# Altium project PWR_MANAGE.PRJPCB
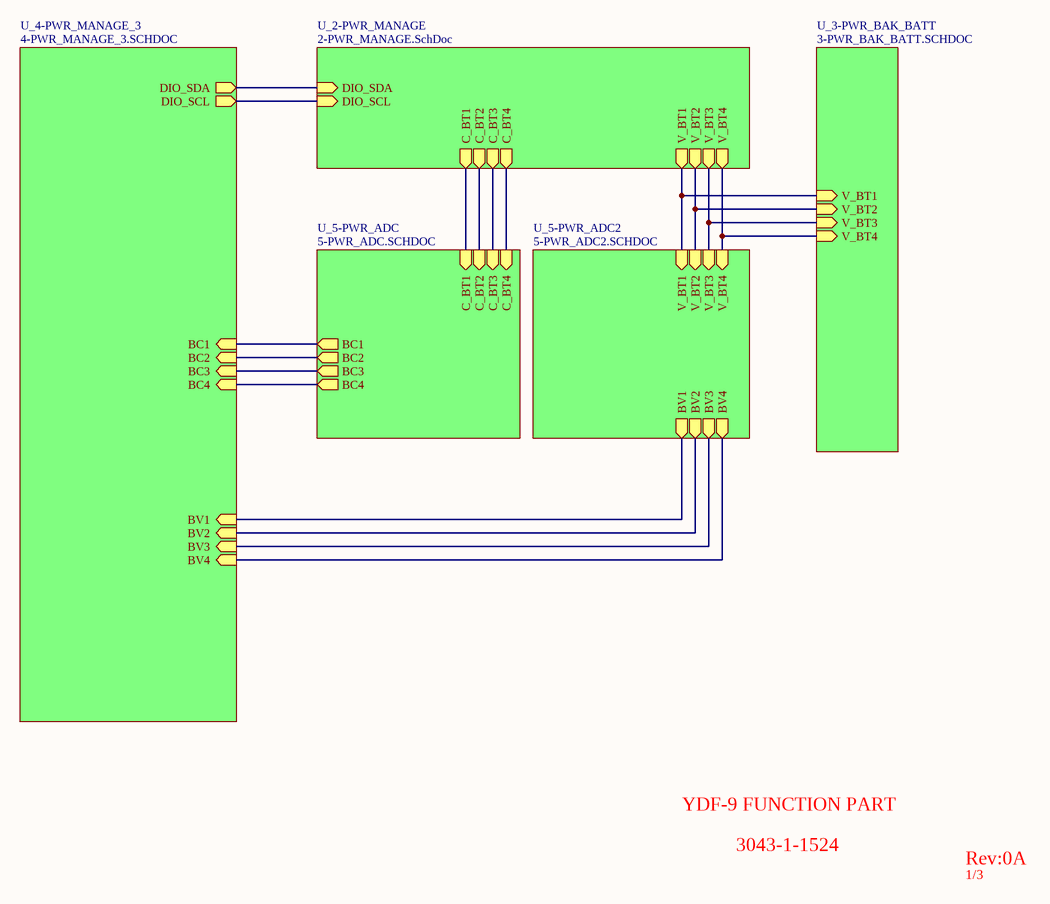
[diagram p0: 0-OverView.SCHDOC]
.TITLE: aaaaa
6 sheets, 155 parts. Net scope: hierarchical (ports join the sheet entries above them; power ports are global).
Board file: 3043-1-1532.PcbDoc
Sheets:
  0-OverView.SCHDOC
    U_2-PWR_MANAGE = 2-PWR_MANAGE.SchDoc
    U_3-PWR_BAK_BATT = 3-PWR_BAK_BATT.SCHDOC
    U_4-PWR_MANAGE_3 = 4-PWR_MANAGE_3.SCHDOC
    U_5-PWR_ADC = 5-PWR_ADC.SCHDOC
    U_5-PWR_ADC2 = 5-PWR_ADC2.SCHDOC

## Sheet 0-OverView.SCHDOC
size A4

### Sub-sheets
U_2-PWR_MANAGE = 2-PWR_MANAGE.SchDoc: V_BT1 (out), V_BT2 (out), V_BT3 (out), V_BT4 (out), C_BT1 (out), C_BT2 (out), C_BT3 (out), C_BT4 (out), DIO_SDA (in), DIO_SCL (in)
U_3-PWR_BAK_BATT = 3-PWR_BAK_BATT.SCHDOC: V_BT2 (in), V_BT4 (in), V_BT1 (in), V_BT3 (in)
U_4-PWR_MANAGE_3 = 4-PWR_MANAGE_3.SCHDOC: DIO_SDA (out), DIO_SCL (out), BC1 (in), BV2 (in), BV1 (in), BV3 (in), BC4 (in), BV4 (in), BC2 (in), BC3 (in)
U_5-PWR_ADC = 5-PWR_ADC.SCHDOC: C_BT1 (in), C_BT2 (in), C_BT3 (in), C_BT4 (in), BC1 (out), BC2 (out), BC3 (out), BC4 (out)
U_5-PWR_ADC2 = 5-PWR_ADC2.SCHDOC: V_BT1 (in), V_BT2 (in), V_BT3 (in), V_BT4 (in), BV2 (out), BV3 (out), BV4 (out), BV1 (out)

### Nets
BC1: sheet U_4-PWR_MANAGE_3/BC1, sheet U_5-PWR_ADC/BC1
BC2: sheet U_4-PWR_MANAGE_3/BC2, sheet U_5-PWR_ADC/BC2
BC3: sheet U_4-PWR_MANAGE_3/BC3, sheet U_5-PWR_ADC/BC3
BC4: sheet U_4-PWR_MANAGE_3/BC4, sheet U_5-PWR_ADC/BC4
BV1: sheet U_4-PWR_MANAGE_3/BV1, sheet U_5-PWR_ADC2/BV1
BV2: sheet U_4-PWR_MANAGE_3/BV2, sheet U_5-PWR_ADC2/BV2
BV3: sheet U_4-PWR_MANAGE_3/BV3, sheet U_5-PWR_ADC2/BV3
BV4: sheet U_4-PWR_MANAGE_3/BV4, sheet U_5-PWR_ADC2/BV4
C_BT1: sheet U_2-PWR_MANAGE/C_BT1, sheet U_5-PWR_ADC/C_BT1
C_BT2: sheet U_2-PWR_MANAGE/C_BT2, sheet U_5-PWR_ADC/C_BT2
C_BT3: sheet U_2-PWR_MANAGE/C_BT3, sheet U_5-PWR_ADC/C_BT3
C_BT4: sheet U_2-PWR_MANAGE/C_BT4, sheet U_5-PWR_ADC/C_BT4
DIO_SCL: sheet U_2-PWR_MANAGE/DIO_SCL, sheet U_4-PWR_MANAGE_3/DIO_SCL
DIO_SDA: sheet U_2-PWR_MANAGE/DIO_SDA, sheet U_4-PWR_MANAGE_3/DIO_SDA
V_BT1: sheet U_2-PWR_MANAGE/V_BT1, sheet U_3-PWR_BAK_BATT/V_BT1, sheet U_5-PWR_ADC2/V_BT1
V_BT2: sheet U_2-PWR_MANAGE/V_BT2, sheet U_3-PWR_BAK_BATT/V_BT2, sheet U_5-PWR_ADC2/V_BT2
V_BT3: sheet U_2-PWR_MANAGE/V_BT3, sheet U_3-PWR_BAK_BATT/V_BT3, sheet U_5-PWR_ADC2/V_BT3
V_BT4: sheet U_2-PWR_MANAGE/V_BT4, sheet U_3-PWR_BAK_BATT/V_BT4, sheet U_5-PWR_ADC2/V_BT4

### Notes on the sheet
- YDF-9 FUNCTION PART
- 3043-1-1524
- Rev:0A
- 1/3

## Sheet 2-PWR_MANAGE.SchDoc
size A4
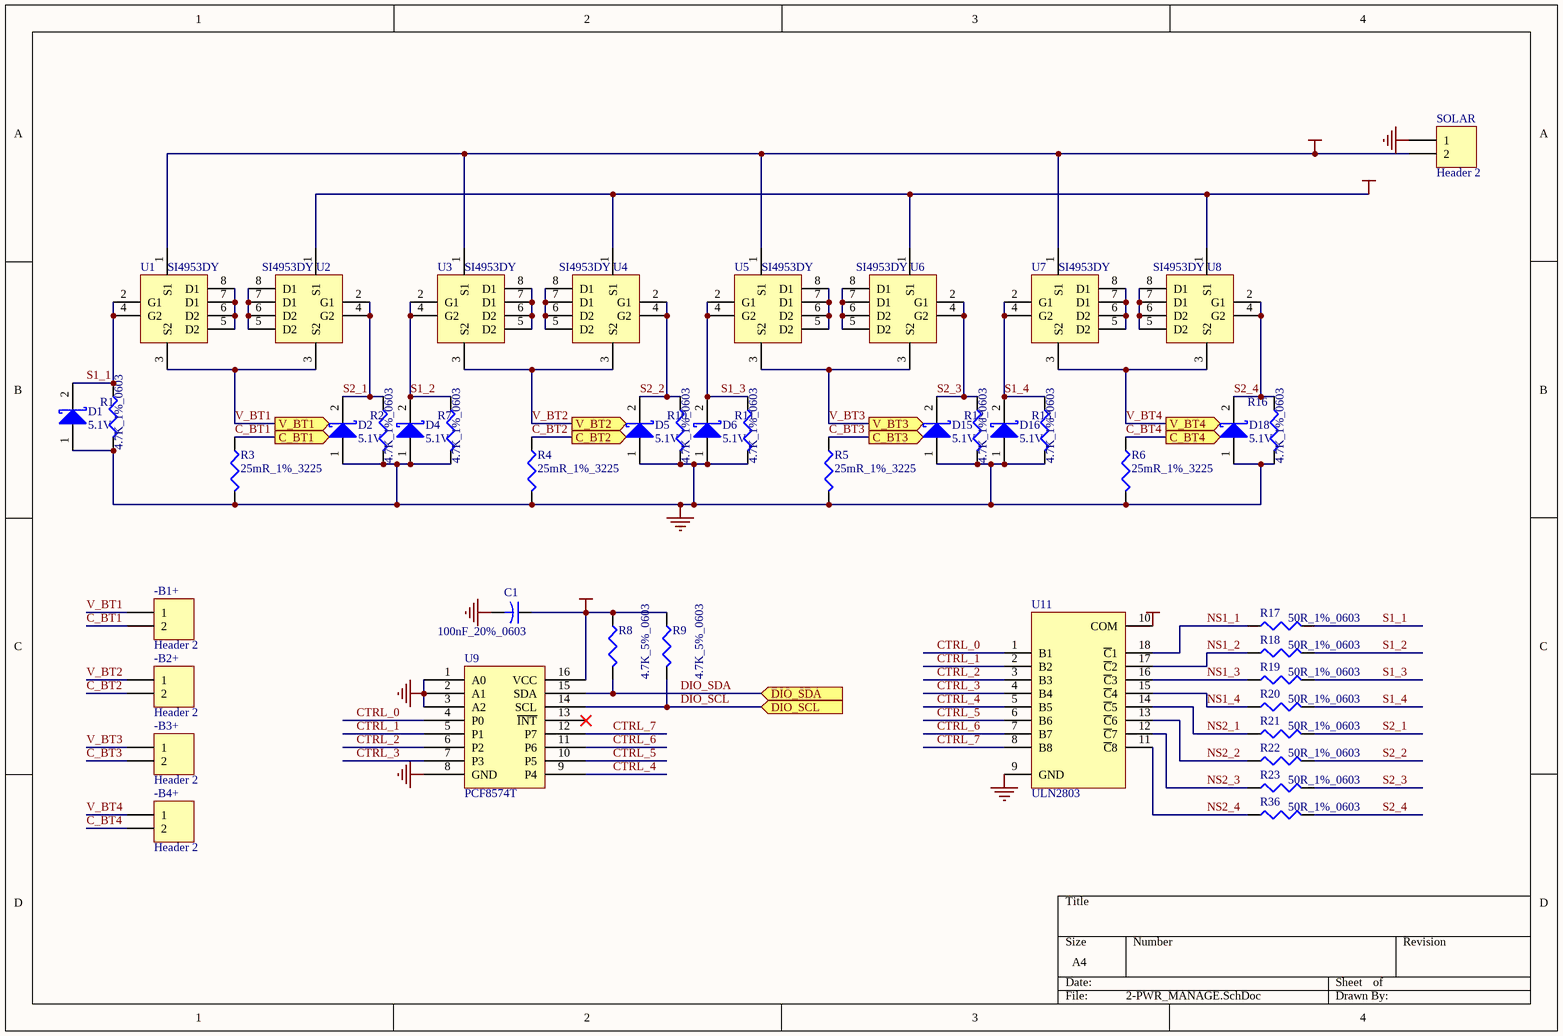
[diagram p1: 2-PWR_MANAGE.SchDoc]

### Parts
-B1+  Header 2  [VH-02H]
-B2+  Header 2  [VH-02H]
-B3+  Header 2  [VH-02H]
-B4+  Header 2  [VH-02H]
C1  100nF_20%_0603  [C1608-0603]
D1  5.1V  [LED0805]
D2  5.1V  [LED0805]
D4  5.1V  [LED0805]
D5  5.1V  [LED0805]
D6  5.1V  [LED0805]
D15  5.1V  [LED0805]
D16  5.1V  [LED0805]
D18  5.1V  [LED0805]
R1  4.7K_1%_0603  [C1608-0603]
R2  4.7K_1%_0603  [C1608-0603]
R3  25mR_1%_3225  [CR6332-2512]
R4  25mR_1%_3225  [CR6332-2512]
R5  25mR_1%_3225  [CR6332-2512]
R6  25mR_1%_3225  [CR6332-2512]
R7  4.7K_1%_0603  [C1608-0603]
R8  4.7K_5%_0603  [C1608-0603]
R9  4.7K_5%_0603  [C1608-0603]
R10  4.7K_1%_0603  [C1608-0603]
R11  4.7K_1%_0603  [C1608-0603]
R12  4.7K_1%_0603  [C1608-0603]
R13  4.7K_1%_0603  [C1608-0603]
R16  4.7K_1%_0603  [C1608-0603]
R17  50R_1%_0603  [C1608-0603]
R18  50R_1%_0603  [C1608-0603]
R19  50R_1%_0603  [C1608-0603]
R20  50R_1%_0603  [C1608-0603]
R21  50R_1%_0603  [C1608-0603]
R22  50R_1%_0603  [C1608-0603]
R23  50R_1%_0603  [C1608-0603]
R36  50R_1%_0603  [C1608-0603]
SOLAR  Header 2  [VH-02H]
U1  SI4953DY  [SO-8]
U2  SI4953DY  [SO-8]
U3  SI4953DY  [SO-8]
U4  SI4953DY  [SO-8]
U5  SI4953DY  [SO-8]
U6  SI4953DY  [SO-8]
U7  SI4953DY  [SO-8]
U8  SI4953DY  [SO-8]
U9  PCF8574T  [SOP16_P1.27_B10]
U11  ULN2803  [SOP18_P1.28_B10]

### Ports
C_BT1 (out), C_BT2 (out), C_BT3 (out), C_BT4 (out), DIO_SCL (in), DIO_SDA (in), V_BT1 (out), V_BT2 (out), V_BT3 (out), V_BT4 (out)

### Nets
GND: C1.2 D1.1(A) D2.1(A) D4.1(A) D5.1(A) D6.1(A) D15.1(A) D16.1(A) D18.1(A) R1.2 R2.2 R3.2 R4.2 R5.2 R6.2 R7.2 R10.2 R11.2 R12.2 R13.2 R16.2 SOLAR.1 U9.1(A0) U9.2(A1) U9.3(A2) U9.8(GND) U11.9(GND)
VCC_3V3: C1.1 R8.1 R9.1 U9.16(VCC)
VCC_5V: U11.10(COM)
VCC_BAT: U2.1(S1) U4.1(S1) U6.1(S1) U8.1(S1)
VCC_CHARGE: SOLAR.2 U1.1(S1) U3.1(S1) U5.1(S1) U7.1(S1)
C_BT1: -B1+.2 R3.1 ; port C_BT1
C_BT2: -B2+.2 R4.1 ; port C_BT2
C_BT3: -B3+.2 R5.1 ; port C_BT3
C_BT4: -B4+.2 R6.1 ; port C_BT4
CTRL_0: U9.4(P0) U11.1(B1)
CTRL_1: U9.5(P1) U11.2(B2)
CTRL_2: U9.6(P2) U11.3(B3)
CTRL_3: U9.7(P3) U11.4(B4)
CTRL_4: U9.9(P4) U11.5(B5)
CTRL_5: U9.10(P5) U11.6(B6)
CTRL_6: U9.11(P6) U11.7(B7)
CTRL_7: U9.12(P7) U11.8(B8)
DIO_SCL: R9.2 U9.14(SCL) ; port DIO_SCL
DIO_SDA: R8.2 U9.15(SDA) ; port DIO_SDA
NS1_1: R17.1 U11.18(~{C}1)
NS1_2: R18.1 U11.17(~{C}2)
NS1_3: R19.1 U11.16(~{C}3)
NS1_4: R20.1 U11.15(~{C}4)
NS2_1: R21.1 U11.14(~{C}5)
NS2_2: R22.1 U11.13(~{C}6)
NS2_3: R23.1 U11.12(~{C}7)
NS2_4: R36.1 U11.11(~{C}8)
S1_1: D1.2(K) R1.1 R17.2 U1.2(G1) U1.4(G2)
S1_2: D4.2(K) R7.1 R18.2 U3.2(G1) U3.4(G2)
S1_3: D6.2(K) R11.1 R19.2 U5.2(G1) U5.4(G2)
S1_4: D16.2(K) R13.1 R20.2 U7.2(G1) U7.4(G2)
S2_1: D2.2(K) R2.1 R21.2 U2.2(G1) U2.4(G2)
S2_2: D5.2(K) R10.1 R22.2 U4.2(G1) U4.4(G2)
S2_3: D15.2(K) R12.1 R23.2 U6.2(G1) U6.4(G2)
S2_4: D18.2(K) R16.1 R36.2 U8.2(G1) U8.4(G2)
V_BT1: -B1+.1 U1.3(S2) U2.3(S2) ; port V_BT1
V_BT2: -B2+.1 U3.3(S2) U4.3(S2) ; port V_BT2
V_BT3: -B3+.1 U5.3(S2) U6.3(S2) ; port V_BT3
V_BT4: -B4+.1 U7.3(S2) U8.3(S2) ; port V_BT4
NetU1_5: U1.5(D2) U1.6(D2) U1.7(D1) U1.8(D1)
NetU2_5: U2.5(D2) U2.6(D2) U2.7(D1) U2.8(D1)
NetU3_5: U3.5(D2) U3.6(D2) U3.7(D1) U3.8(D1)
NetU4_5: U4.5(D2) U4.6(D2) U4.7(D1) U4.8(D1)
NetU5_5: U5.5(D2) U5.6(D2) U5.7(D1) U5.8(D1)
NetU6_5: U6.5(D2) U6.6(D2) U6.7(D1) U6.8(D1)
NetU7_5: U7.5(D2) U7.6(D2) U7.7(D1) U7.8(D1)
NetU8_5: U8.5(D2) U8.6(D2) U8.7(D1) U8.8(D1)

Not connected (* = marked no-connect by the designer): U9 13(~{INT})*

### Library data of the parts
-B1+ -B2+ -B3+ -B4+ SOLAR = Header 2: Header, 2-Pin; LatestRevisionDate: 17-Jul-2002; LatestRevisionNote: Re-released for DXP Platform.; Publisher: Altium Limited
C1 = Cap2: Capacitor; Value: 0.1uF; Published: 23-Sep-2002; Publisher: Altium Limited
D1 D2 D4-D6 D15 D16 D18 = D Schottky: Schottky Diode; Code - JEDEC: DO-214-AA; Published: 8-Jun-2000; Revision: July-2002: Re-released for DXP Platform.; Publisher: Altium Limited
R1 R2 R7-R13 R16-R23 R36 = Res3: Resistor; Value: 1K%5 0603; Published: 8-Jun-2000; Revision: July-2002: Re-released for DXP Platform.; Publisher: Altium Limited
R3-R6 = Res3: Resistor; Value: 150R %5 0603; Published: 8-Jun-2000; Revision: July-2002: Re-released for DXP Platform.; Publisher: Altium Limited

## Sheet 3-PWR_BAK_BATT.SCHDOC
size A4
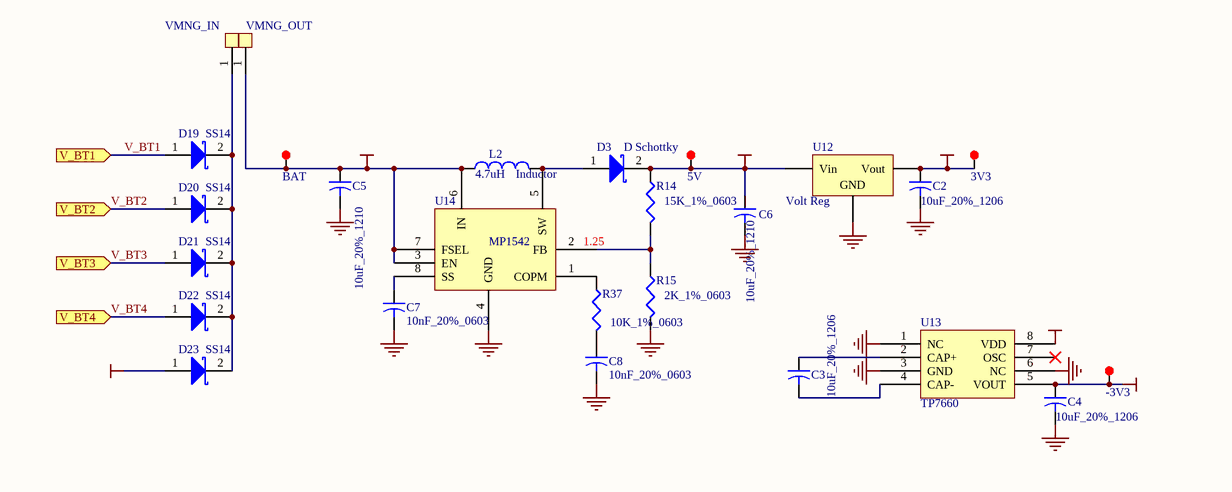
[diagram p2: 3-PWR_BAK_BATT.SCHDOC]

### Parts
3V3  TP  [TP_1MM]  (value not drawn)
5V  TP  [TP_1MM]  (value not drawn)
-3V3  TP  [TP_1MM]  (value not drawn)
BAT  TP  [TP_1MM]  (value not drawn)
C2  10uF_20%_1206  [CC3216-1206]
C3  10uF_20%_1206  [CC3216-1206]
C4  10uF_20%_1206  [CC3216-1206]
C5  10uF_20%_1210  [CC3225-1210]
C6  10uF_20%_1210  [CC3225-1210]
C7  10nF_20%_0603  [C1608-0603]
C8  10nF_20%_0603  [C1608-0603]
D3  D Schottky  [DO-214AB_SS14]
D19  SS14  [DO-214AB_SS14]
D20  SS14  [DO-214AB_SS14]
D21  SS14  [DO-214AB_SS14]
D22  SS14  [DO-214AB_SS14]
D23  SS14  [DO-214AB_SS14]
L2  Inductor  value 4.7uH  [L6x6x3_3A]
R14  15K_1%_0603  [C1608-0603]
R15  2K_1%_0603  [C1608-0603]
R37  10K_1%_0603  [C1608-0603]
U12  Volt Reg  [SOT223]
U13  TP7660  [SO-8]
U14  MP1542  [MSOP8]
VMNG_IN  ND  [END_3_6]  (value not drawn)
VMNG_OUT  ND  [END_3_6]  (value not drawn)

### Ports
V_BT1 (in), V_BT2 (in), V_BT3 (in), V_BT4 (in)

### Nets
GND: C2.2 C4.2 C5.2 C6.2 C7.2 C8.2 R15.2 U12.2(GND) U13.1(NC) U13.3(GND) U13.6(NC) U14.4(GND)
VCC_3V3: 3V3.1(TP) C2.1 U12.3(Vout) U13.8(VDD)
VCC_5V: 5V.1(TP) C6.1 D3.2(K) R14.1 U12.1(Vin)
VCC_-3V3: -3V3.1(TP) C4.1 U13.5(VOUT)
VCC_CHARGE: D23.1(A)
VCC_MNG: BAT.1(TP) C5.1 L2.1 U14.3(EN) U14.6(IN) U14.7(FSEL) VMNG_OUT.1(SW)
V_BT1: D19.1(A) ; port V_BT1
V_BT2: D20.1(A) ; port V_BT2
V_BT3: D21.1(A) ; port V_BT3
V_BT4: D22.1(A) ; port V_BT4
NetC3_1: C3.1 U13.2(CAP+)
NetC3_2: C3.2 U13.4(CAP-)
NetC7_1: C7.1 U14.8(SS)
NetC8_1: C8.1 R37.2
NetD3_1: D3.1(A) L2.2 U14.5(SW)
NetD19_2: D19.2(K) D20.2(K) D21.2(K) D22.2(K) D23.2(K) VMNG_IN.1(SW)
NetR14_2: R14.2 R15.1 U14.2(FB)
NetR37_1: R37.1 U14.1(COPM)

Not connected (* = marked no-connect by the designer): U13 7(OSC)*

### Notes on the sheet
- 1.25

### Library data of the parts
3V3 5V -3V3 BAT = TP_1mm
C2-C4 = Cap2: Capacitor; Value: 10uF; Published: 23-Sep-2002; Publisher: Altium Limited
C5-C8 = Cap2: Capacitor; Value: 0.1uF 20% 0603; Published: 23-Sep-2002; Publisher: Altium Limited
D3 D19-D23 = D Schottky: Schottky Diode; Code - JEDEC: DO-214-AA; Published: 8-Jun-2000; Revision: July-2002: Re-released for DXP Platform.; Publisher: Altium Limited
R14 R15 R37 = Res3: Resistor; Value: 1K%5 0603; Published: 8-Jun-2000; Revision: July-2002: Re-released for DXP Platform.; Publisher: Altium Limited
U12 = Volt Reg: Voltage Regulator; Published: 24-Mar-1999; LatestRevisionDate: 17-Jul-2002; LatestRevisionNote: Re-released for DXP Platform.; Publisher: Altium Limited; Code_JEDEC: SMD-220
L2 = Inductor: Published: 8-Jun-2000; Revision: July-2002: Re-released for DXP Platform.; Publisher: Altium Limited

## Sheet 4-PWR_MANAGE_3.SCHDOC
size A4
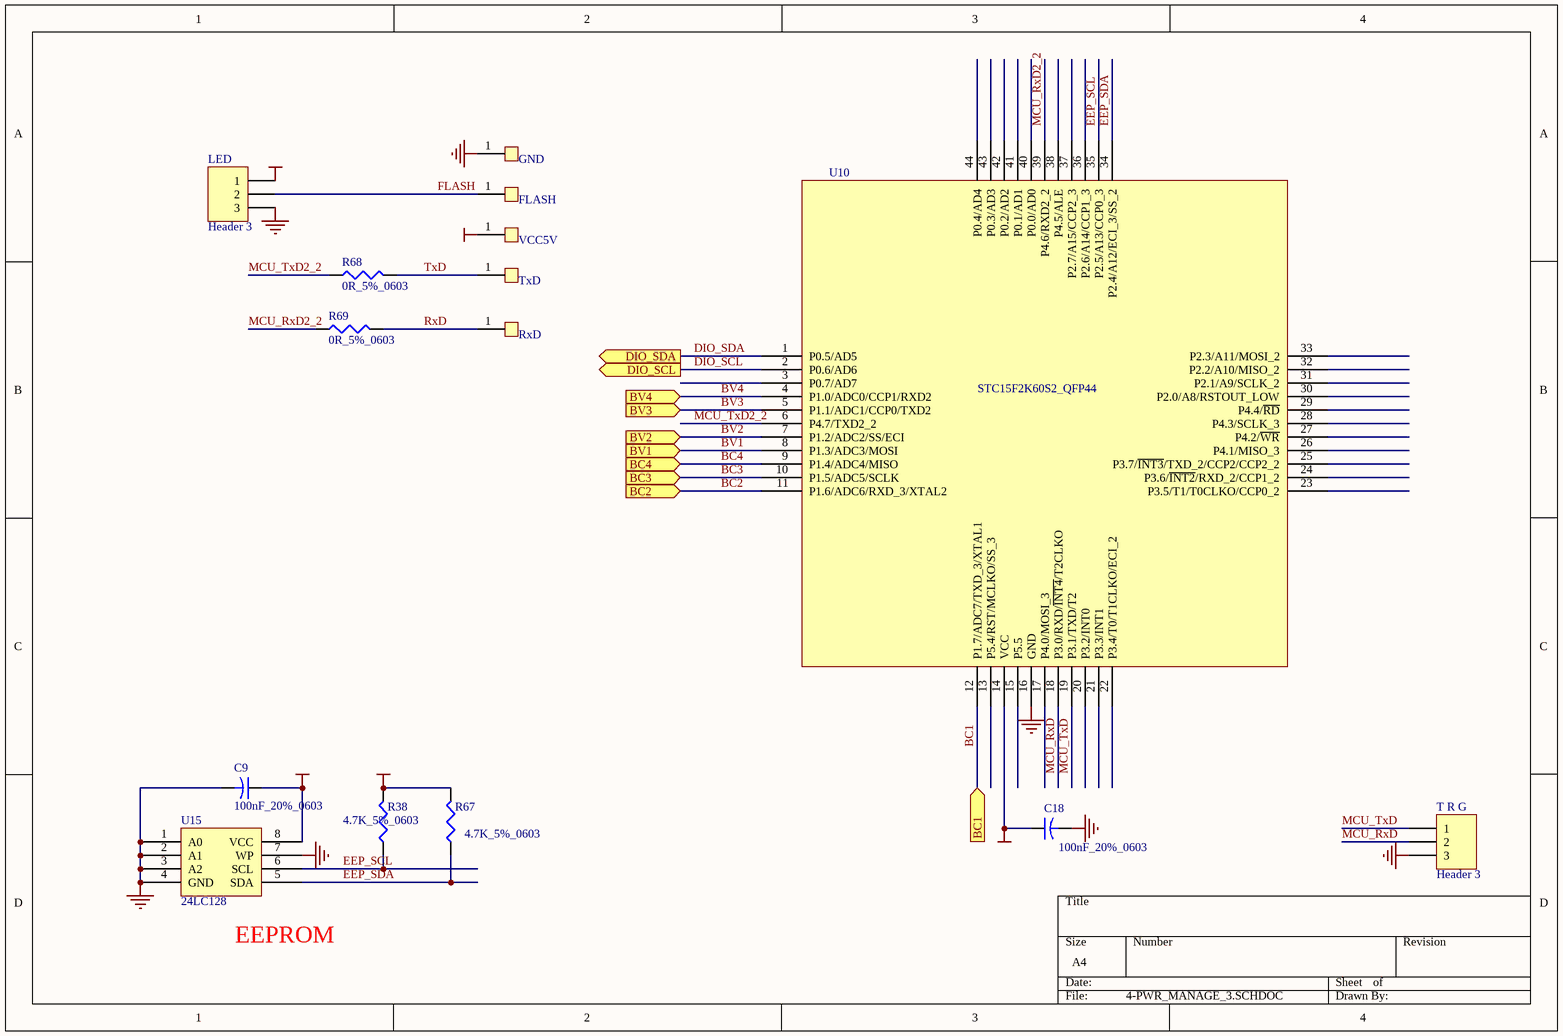
[diagram p3: 4-PWR_MANAGE_3.SCHDOC]

### Parts
C9  100nF_20%_0603  [C1608-0603]
C18  100nF_20%_0603  [C1608-0603]
FLASH  ND  [END_3_6]  (value not drawn)
GND  ND  [END_3_6]  (value not drawn)
LED  Header 3  [VH-03H]
R38  4.7K_5%_0603  [C1608-0603]
R67  4.7K_5%_0603  [C1608-0603]
R68  0R_5%_0603  [C1608-0603]
R69  0R_5%_0603  [C1608-0603]
RxD  ND  [END_3_6]  (value not drawn)
T_R_G  Header 3  [XH-03H]
TxD  ND  [END_3_6]  (value not drawn)
U10  STC15F2K60S2_QFP44  [PQFP44]
U15  24LC128  [8s1]
VCC5V  ND  [END_3_6]  (value not drawn)

### Ports
BC1 (in), BC2 (in), BC3 (in), BC4 (in), BV1 (in), BV2 (in), BV3 (in), BV4 (in), DIO_SCL (out), DIO_SDA (out)

### Nets
GND: C9.2 C18.2 GND.1(SW) LED.3 T_R_G.3 U10.16(GND) U15.1(A0) U15.2(A1) U15.3(A2) U15.4(GND) U15.7(WP)
VCC_3V3: C9.1 C18.1 R38.2 R67.2 U10.14(VCC) U15.8(VCC)
VCC_5V: VCC5V.1(SW)
VCC_BAT: LED.1
BC1: U10.12(P1.7/ADC7/TXD_3/XTAL1) ; port BC1
BC2: U10.11(P1.6/ADC6/RXD_3/XTAL2) ; port BC2
BC3: U10.10(P1.5/ADC5/SCLK) ; port BC3
BC4: U10.9(P1.4/ADC4/MISO) ; port BC4
BV1: U10.8(P1.3/ADC3/MOSI) ; port BV1
BV2: U10.7(P1.2/ADC2/SS/ECI) ; port BV2
BV3: U10.5(P1.1/ADC1/CCP0/TXD2) ; port BV3
BV4: U10.4(P1.0/ADC0/CCP1/RXD2) ; port BV4
DIO_SCL: U10.2(P0.6/AD6) ; port DIO_SCL
DIO_SDA: U10.1(P0.5/AD5) ; port DIO_SDA
EEP_SCL: R38.1 U10.35(P2.5/A13/CCP0_3) U15.6(SCL)
EEP_SDA: R67.1 U10.34(P2.4/A12/ECI_3/SS_2) U15.5(SDA)
FLASH: FLASH.1(SW) LED.2
MCU_RxD: T_R_G.2 U10.18(P3.0/RXD/~{INT4}/T2CLKO)
MCU_RxD2_2: R69.1 U10.39(P4.6/RXD2_2)
MCU_TxD: T_R_G.1 U10.19(P3.1/TXD/T2)
MCU_TxD2_2: R68.1 U10.6(P4.7/TXD2_2)
RxD: R69.2 RxD.1(SW)
TxD: R68.2 TxD.1(SW)

Not connected (* = marked no-connect by the designer): U10 3(P0.7/AD7) 13(P5.4/RST/MCLKO/SS_3) 15(P5.5) 17(P4.0/MOSI_3) 20(P3.2/INT0) 21(P3.3/INT1) 22(P3.4/T0/T1CLKO/ECI_2) 23(P3.5/T1/T0CLKO/CCP0_2) 24(P3.6/~{INT2}/RXD_2/CCP1_2) 25(P3.7/~{INT3}/TXD_2/CCP2/CCP2_2) 26(P4.1/MISO_3) 27(P4.2/~{WR}) 28(P4.3/SCLK_3) 29(P4.4/~{RD}) 30(P2.0/A8/RSTOUT_LOW) 31(P2.1/A9/SCLK_2) 32(P2.2/A10/MISO_2) 33(P2.3/A11/MOSI_2) 36(P2.6/A14/CCP1_3) 37(P2.7/A15/CCP2_3) 38(P4.5/ALE) 40(P0.0/AD0) 41(P0.1/AD1) 42(P0.2/AD2) 43(P0.3/AD3) 44(P0.4/AD4)

### Notes on the sheet
- (near U15) EEPROM

### Library data of the parts
C9 = Cap2: Capacitor; Value: 0.1uF 0603; Published: 23-Sep-2002; Publisher: Altium Limited
C18 = Cap2: Capacitor; Value: 0.1uF 20% 0603; Published: 23-Sep-2002; Publisher: Altium Limited
LED T_R_G = Header 3: Header, 3-Pin; LatestRevisionDate: 17-Jul-2002; LatestRevisionNote: Re-released for DXP Platform.; Publisher: Altium Limited
R38 R67-R69 = Res3: Resistor; Value: 1K%5 0603; Published: 8-Jun-2000; Revision: July-2002: Re-released for DXP Platform.; Publisher: Altium Limited
U15 = 24LC02: IC

## Sheet 5-PWR_ADC.SCHDOC
size A4
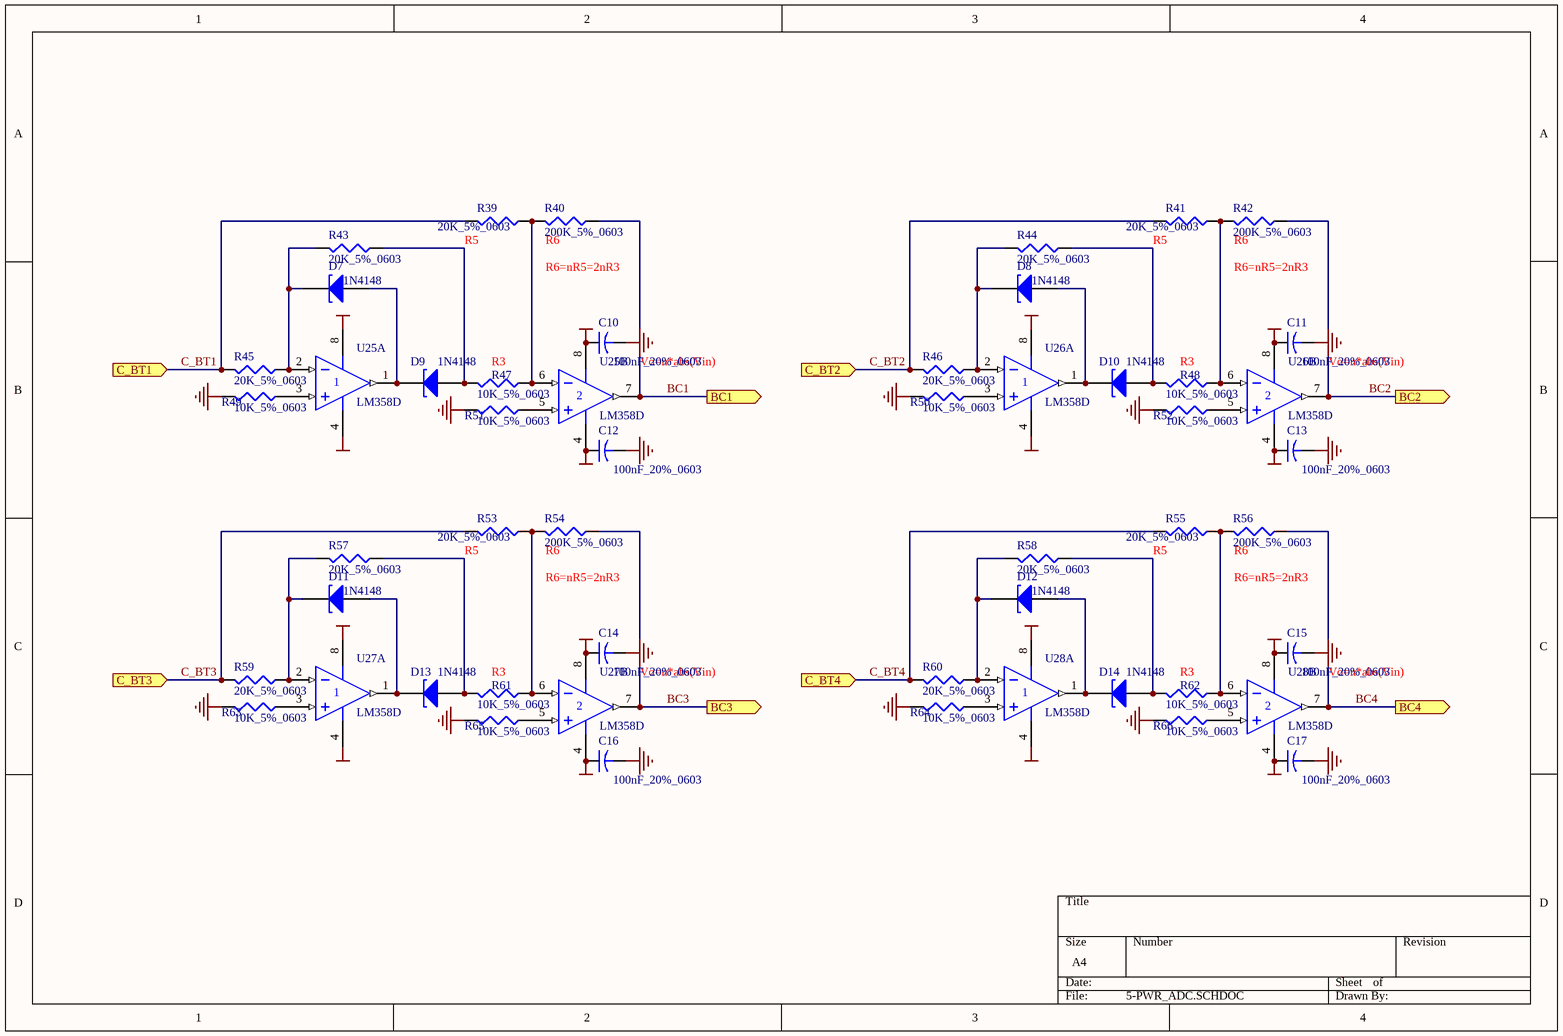
[diagram p4: 5-PWR_ADC.SCHDOC]

### Parts
C10  100nF_20%_0603  [C1608-0603]
C11  100nF_20%_0603  [C1608-0603]
C12  100nF_20%_0603  [C1608-0603]
C13  100nF_20%_0603  [C1608-0603]
C14  100nF_20%_0603  [C1608-0603]
C15  100nF_20%_0603  [C1608-0603]
C16  100nF_20%_0603  [C1608-0603]
C17  100nF_20%_0603  [C1608-0603]
D7  1N4148  [LED0805]
D8  1N4148  [LED0805]
D9  1N4148  [LED0805]
D10  1N4148  [LED0805]
D11  1N4148  [LED0805]
D12  1N4148  [LED0805]
D13  1N4148  [LED0805]
D14  1N4148  [LED0805]
R39  20K_5%_0603  [C1608-0603]
R40  200K_5%_0603  [C1608-0603]
R41  20K_5%_0603  [C1608-0603]
R42  200K_5%_0603  [C1608-0603]
R43  20K_5%_0603  [C1608-0603]
R44  20K_5%_0603  [C1608-0603]
R45  20K_5%_0603  [C1608-0603]
R46  20K_5%_0603  [C1608-0603]
R47  10K_5%_0603  [C1608-0603]
R48  10K_5%_0603  [C1608-0603]
R49  10K_5%_0603  [C1608-0603]
R50  10K_5%_0603  [C1608-0603]
R51  10K_5%_0603  [C1608-0603]
R52  10K_5%_0603  [C1608-0603]
R53  20K_5%_0603  [C1608-0603]
R54  200K_5%_0603  [C1608-0603]
R55  20K_5%_0603  [C1608-0603]
R56  200K_5%_0603  [C1608-0603]
R57  20K_5%_0603  [C1608-0603]
R58  20K_5%_0603  [C1608-0603]
R59  20K_5%_0603  [C1608-0603]
R60  20K_5%_0603  [C1608-0603]
R61  10K_5%_0603  [C1608-0603]
R62  10K_5%_0603  [C1608-0603]
R63  10K_5%_0603  [C1608-0603]
R64  10K_5%_0603  [C1608-0603]
R65  10K_5%_0603  [C1608-0603]
R66  10K_5%_0603  [C1608-0603]
U25  LM358D  [751-02]  (parts A,B of 2)
U26  LM358D  [751-02]  (parts A,B of 2)
U27  LM358D  [751-02]  (parts A,B of 2)
U28  LM358D  [751-02]  (parts A,B of 2)

### Ports
BC1 (out), BC2 (out), BC3 (out), BC4 (out), C_BT1 (in), C_BT2 (in), C_BT3 (in), C_BT4 (in)

### Nets
GND: C10.2 C11.2 C12.2 C13.2 C14.2 C15.2 C16.2 C17.2 R49.2 R50.2 R51.2 R52.2 R63.2 R64.2 R65.2 R66.2
VCC_3V3: C10.1 C11.1 C14.1 C15.1 U25.8(V+) U26.8(V+) U27.8(V+) U28.8(V+)
VCC_-3V3: C12.1 C13.1 C16.1 C17.1 U25.4(V-) U26.4(V-) U27.4(V-) U28.4(V-)
BC1: R40.1 U25.7(OUT) ; port BC1
BC2: R42.1 U26.7(OUT) ; port BC2
BC3: R54.1 U27.7(OUT) ; port BC3
BC4: R56.1 U28.7(OUT) ; port BC4
C_BT1: R39.2 R45.2 ; port C_BT1
C_BT2: R41.2 R46.2 ; port C_BT2
C_BT3: R53.2 R59.2 ; port C_BT3
C_BT4: R55.2 R60.2 ; port C_BT4
NetD7_1: D7.1(A) D9.2(K) U25.1(OUT)
NetD7_2: D7.2(K) R43.2 R45.1 U25.2(IN-)
NetD8_1: D8.1(A) D10.2(K) U26.1(OUT)
NetD8_2: D8.2(K) R44.2 R46.1 U26.2(IN-)
NetD9_1: D9.1(A) R43.1 R47.2
NetD10_1: D10.1(A) R44.1 R48.2
NetD11_1: D11.1(A) D13.2(K) U27.1(OUT)
NetD11_2: D11.2(K) R57.2 R59.1 U27.2(IN-)
NetD12_1: D12.1(A) D14.2(K) U28.1(OUT)
NetD12_2: D12.2(K) R58.2 R60.1 U28.2(IN-)
NetD13_1: D13.1(A) R57.1 R61.2
NetD14_1: D14.1(A) R58.1 R62.2
NetR39_1: R39.1 R40.2 R47.1 U25.6(IN-)
NetR41_1: R41.1 R42.2 R48.1 U26.6(IN-)
NetR49_1: R49.1 U25.3(IN+)
NetR50_1: R50.1 U26.3(IN+)
NetR51_1: R51.1 U25.5(IN+)
NetR52_1: R52.1 U26.5(IN+)
NetR53_1: R53.1 R54.2 R61.1 U27.6(IN-)
NetR55_1: R55.1 R56.2 R62.1 U28.6(IN-)
NetR63_1: R63.1 U27.3(IN+)
NetR64_1: R64.1 U28.3(IN+)
NetR65_1: R65.1 U27.5(IN+)
NetR66_1: R66.1 U28.5(IN+)

### Notes on the sheet
- (near R39) R5
- (near R40) R6
- (near R41) R5
- (near R42) R6
- R6=nR5=2nR3
- (near R47) R3
- Vo=n*abs(Vin)
- (near R48) R3
- (near R53) R5
- (near R54) R6
- (near R55) R5
- (near R56) R6
- (near R61) R3
- (near R62) R3

### Library data of the parts
C10-C17 = Cap2: Capacitor; Value: 0.1uF 20% 0603; Published: 23-Sep-2002; Publisher: Altium Limited
D7-D14 = D Tunnel1: Tunnel Diode - RLC Model; Published: 8-Jun-2000; LatestRevisionDate: 17-Jul-2002; LatestRevisionNote: Re-released for DXP Platform.; Publisher: Altium Limited
R39-R66 = Res3: Resistor; Value: 150R %5 0603; Published: 8-Jun-2000; Revision: July-2002: Re-released for DXP Platform.; Publisher: Altium Limited
U25-U28 = LM358D: Dual Low-Power Operational Amplifier; Published: 17-Jul-2002; DatasheetDocument: 1988; PackageReference: 751-02; Publisher: Altium Limited; Code_JEDEC: MS-012-AA; Code_IPC: SO8

## Sheet 5-PWR_ADC2.SCHDOC
size A4
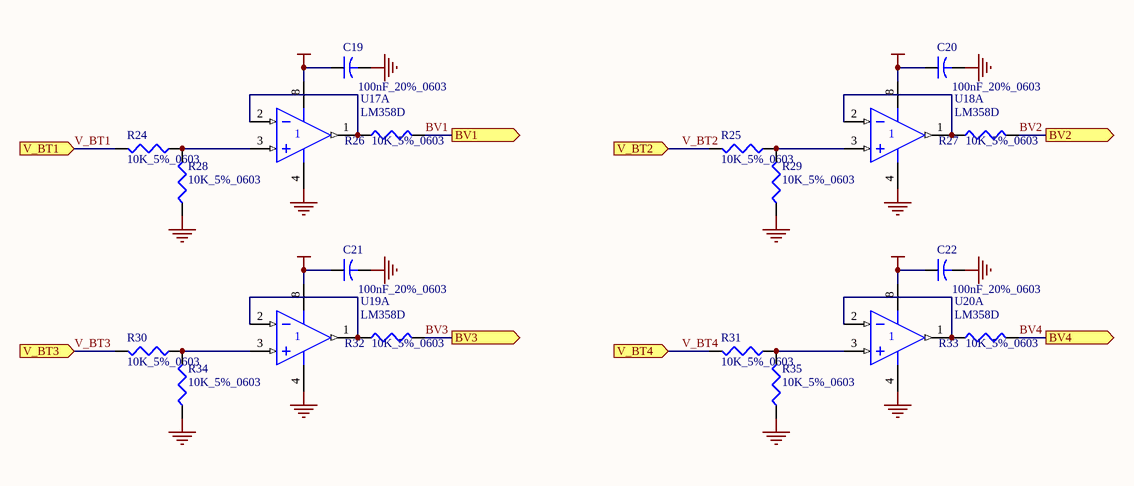
[diagram p5: 5-PWR_ADC2.SCHDOC]

### Parts
C19  100nF_20%_0603  [C1608-0603]
C20  100nF_20%_0603  [C1608-0603]
C21  100nF_20%_0603  [C1608-0603]
C22  100nF_20%_0603  [C1608-0603]
R24  10K_5%_0603  [C1608-0603]
R25  10K_5%_0603  [C1608-0603]
R26  10K_5%_0603  [C1608-0603]
R27  10K_5%_0603  [C1608-0603]
R28  10K_5%_0603  [C1608-0603]
R29  10K_5%_0603  [C1608-0603]
R30  10K_5%_0603  [C1608-0603]
R31  10K_5%_0603  [C1608-0603]
R32  10K_5%_0603  [C1608-0603]
R33  10K_5%_0603  [C1608-0603]
R34  10K_5%_0603  [C1608-0603]
R35  10K_5%_0603  [C1608-0603]
U17  LM358D  [751-02]  (part A of 2)
U18  LM358D  [751-02]  (part A of 2)
U19  LM358D  [751-02]  (part A of 2)
U20  LM358D  [751-02]  (part A of 2)

### Ports
BV1 (out), BV2 (out), BV3 (out), BV4 (out), V_BT1 (in), V_BT2 (in), V_BT3 (in), V_BT4 (in)

### Nets
GND: C19.2 C20.2 C21.2 C22.2 R28.1 R29.1 R34.1 R35.1 U17.4(V-) U18.4(V-) U19.4(V-) U20.4(V-)
VCC_3V3: C19.1 C20.1 C21.1 C22.1 U17.8(V+) U18.8(V+) U19.8(V+) U20.8(V+)
BV1: R26.2 ; port BV1
BV2: R27.2 ; port BV2
BV3: R32.2 ; port BV3
BV4: R33.2 ; port BV4
V_BT1: R24.2 ; port V_BT1
V_BT2: R25.2 ; port V_BT2
V_BT3: R30.2 ; port V_BT3
V_BT4: R31.2 ; port V_BT4
NetR24_1: R24.1 R28.2 U17.3(IN+)
NetR25_1: R25.1 R29.2 U18.3(IN+)
NetR26_1: R26.1 U17.1(OUT) U17.2(IN-)
NetR27_1: R27.1 U18.1(OUT) U18.2(IN-)
NetR30_1: R30.1 R34.2 U19.3(IN+)
NetR31_1: R31.1 R35.2 U20.3(IN+)
NetR32_1: R32.1 U19.1(OUT) U19.2(IN-)
NetR33_1: R33.1 U20.1(OUT) U20.2(IN-)

### Library data of the parts
C19-C22 = Cap2: Capacitor; Value: 0.1uF 20% 0603; Published: 23-Sep-2002; Publisher: Altium Limited
R24-R35 = Res3: Resistor; Value: 150R %5 0603; Published: 8-Jun-2000; Revision: July-2002: Re-released for DXP Platform.; Publisher: Altium Limited
U17-U20 = LM358D: Dual Low-Power Operational Amplifier; Published: 17-Jul-2002; DatasheetDocument: 1988; PackageReference: 751-02; Publisher: Altium Limited; Code_JEDEC: MS-012-AA; Code_IPC: SO8

## Nets that join several sheets
GND: 2-PWR_MANAGE (27 pins), 3-PWR_BAK_BATT (12 pins), 4-PWR_MANAGE_3 (11 pins), 5-PWR_ADC (16 pins), 5-PWR_ADC2 (12 pins)
VCC_3V3: 2-PWR_MANAGE (C1.1 R8.1 R9.1 U9.16), 3-PWR_BAK_BATT (3V3.1 C2.1 U12.3 U13.8), 4-PWR_MANAGE_3 (6 pins), 5-PWR_ADC (8 pins), 5-PWR_ADC2 (8 pins)
VCC_5V: 2-PWR_MANAGE (U11.10), 3-PWR_BAK_BATT (5 pins), 4-PWR_MANAGE_3 (VCC5V.1)
VCC_-3V3: 3-PWR_BAK_BATT (-3V3.1 C4.1 U13.5), 5-PWR_ADC (8 pins)
VCC_BAT: 2-PWR_MANAGE (U2.1 U4.1 U6.1 U8.1), 4-PWR_MANAGE_3 (LED.1)
VCC_CHARGE: 2-PWR_MANAGE (5 pins), 3-PWR_BAK_BATT (D23.1)
BC1: 4-PWR_MANAGE_3 (U10.12), 5-PWR_ADC (R40.1 U25.7)
BC2: 4-PWR_MANAGE_3 (U10.11), 5-PWR_ADC (R42.1 U26.7)
BC3: 4-PWR_MANAGE_3 (U10.10), 5-PWR_ADC (R54.1 U27.7)
BC4: 4-PWR_MANAGE_3 (U10.9), 5-PWR_ADC (R56.1 U28.7)
BV1: 4-PWR_MANAGE_3 (U10.8), 5-PWR_ADC2 (R26.2)
BV2: 4-PWR_MANAGE_3 (U10.7), 5-PWR_ADC2 (R27.2)
BV3: 4-PWR_MANAGE_3 (U10.5), 5-PWR_ADC2 (R32.2)
BV4: 4-PWR_MANAGE_3 (U10.4), 5-PWR_ADC2 (R33.2)
C_BT1: 2-PWR_MANAGE (-B1+.2 R3.1), 5-PWR_ADC (R39.2 R45.2)
C_BT2: 2-PWR_MANAGE (-B2+.2 R4.1), 5-PWR_ADC (R41.2 R46.2)
C_BT3: 2-PWR_MANAGE (-B3+.2 R5.1), 5-PWR_ADC (R53.2 R59.2)
C_BT4: 2-PWR_MANAGE (-B4+.2 R6.1), 5-PWR_ADC (R55.2 R60.2)
DIO_SCL: 2-PWR_MANAGE (R9.2 U9.14), 4-PWR_MANAGE_3 (U10.2)
DIO_SDA: 2-PWR_MANAGE (R8.2 U9.15), 4-PWR_MANAGE_3 (U10.1)
V_BT1: 2-PWR_MANAGE (-B1+.1 U1.3 U2.3), 3-PWR_BAK_BATT (D19.1), 5-PWR_ADC2 (R24.2)
V_BT2: 2-PWR_MANAGE (-B2+.1 U3.3 U4.3), 3-PWR_BAK_BATT (D20.1), 5-PWR_ADC2 (R25.2)
V_BT3: 2-PWR_MANAGE (-B3+.1 U5.3 U6.3), 3-PWR_BAK_BATT (D21.1), 5-PWR_ADC2 (R30.2)
V_BT4: 2-PWR_MANAGE (-B4+.1 U7.3 U8.3), 3-PWR_BAK_BATT (D22.1), 5-PWR_ADC2 (R31.2)